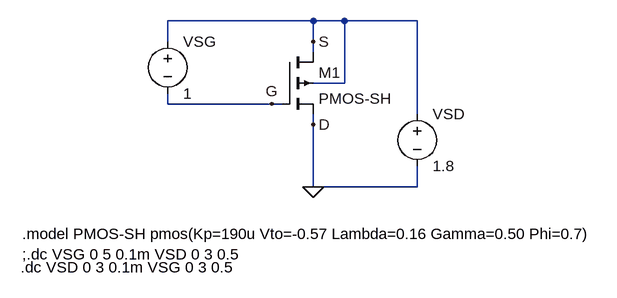
[diagram p0: schematic PMOS.asc]
PMOS.asc, the LTspice schematic file:
Version 4
SHEET 1 900 680
WIRE 384 32 160 32
WIRE 432 32 384 32
WIRE 544 32 432 32
WIRE 160 64 160 32
WIRE 384 64 384 32
WIRE 384 80 384 64
WIRE 432 128 432 32
WIRE 432 128 384 128
WIRE 160 160 160 144
WIRE 320 160 160 160
WIRE 336 160 320 160
WIRE 544 176 544 32
WIRE 384 192 384 176
WIRE 384 288 384 192
WIRE 544 288 544 256
WIRE 544 288 384 288
FLAG 384 288 0
FLAG 384 192 D
FLAG 320 160 G
FLAG 384 64 S
SYMBOL voltage 160 48 R0
WINDOW 123 0 0 Left 0
WINDOW 39 0 0 Left 0
SYMATTR InstName VSG
SYMATTR Value 1
SYMBOL voltage 544 160 R0
WINDOW 123 0 0 Left 0
WINDOW 39 0 0 Left 0
SYMATTR InstName VSD
SYMATTR Value 1.8
SYMBOL pmos4 336 80 R0
SYMATTR InstName M1
SYMATTR Value PMOS-SH
TEXT -64 360 Left 2 !.model PMOS-SH pmos(Kp=190u Vto=-0.57 Lambda=0.16 Gamma=0.50 Phi=0.7)
TEXT -64 392 Left 2 !;.dc VSG 0 5 0.1m VSD 0 3 0.5
TEXT -66 412 Left 2 !.dc VSD 0 3 0.1m VSG 0 3 0.5

The netlist it stands for:
* PMOS.asc
VSG S G 1
VSD S 0 1.8
M1 S G 0 S PMOS-SH
.model NMOS NMOS
.model PMOS PMOS
.lib standard.mos
.model PMOS-SH pmos(Kp=190u Vto=-0.57 Lambda=0.16 Gamma=0.50 Phi=0.7)
;.dc VSG 0 5 0.1m VSD 0 3 0.5
.dc VSD 0 3 0.1m VSG 0 3 0.5
.backanno
.end